# Altium schematic sheet Schema.SchDoc
size A4; SheetNumber: 2; SheetTotal: 6
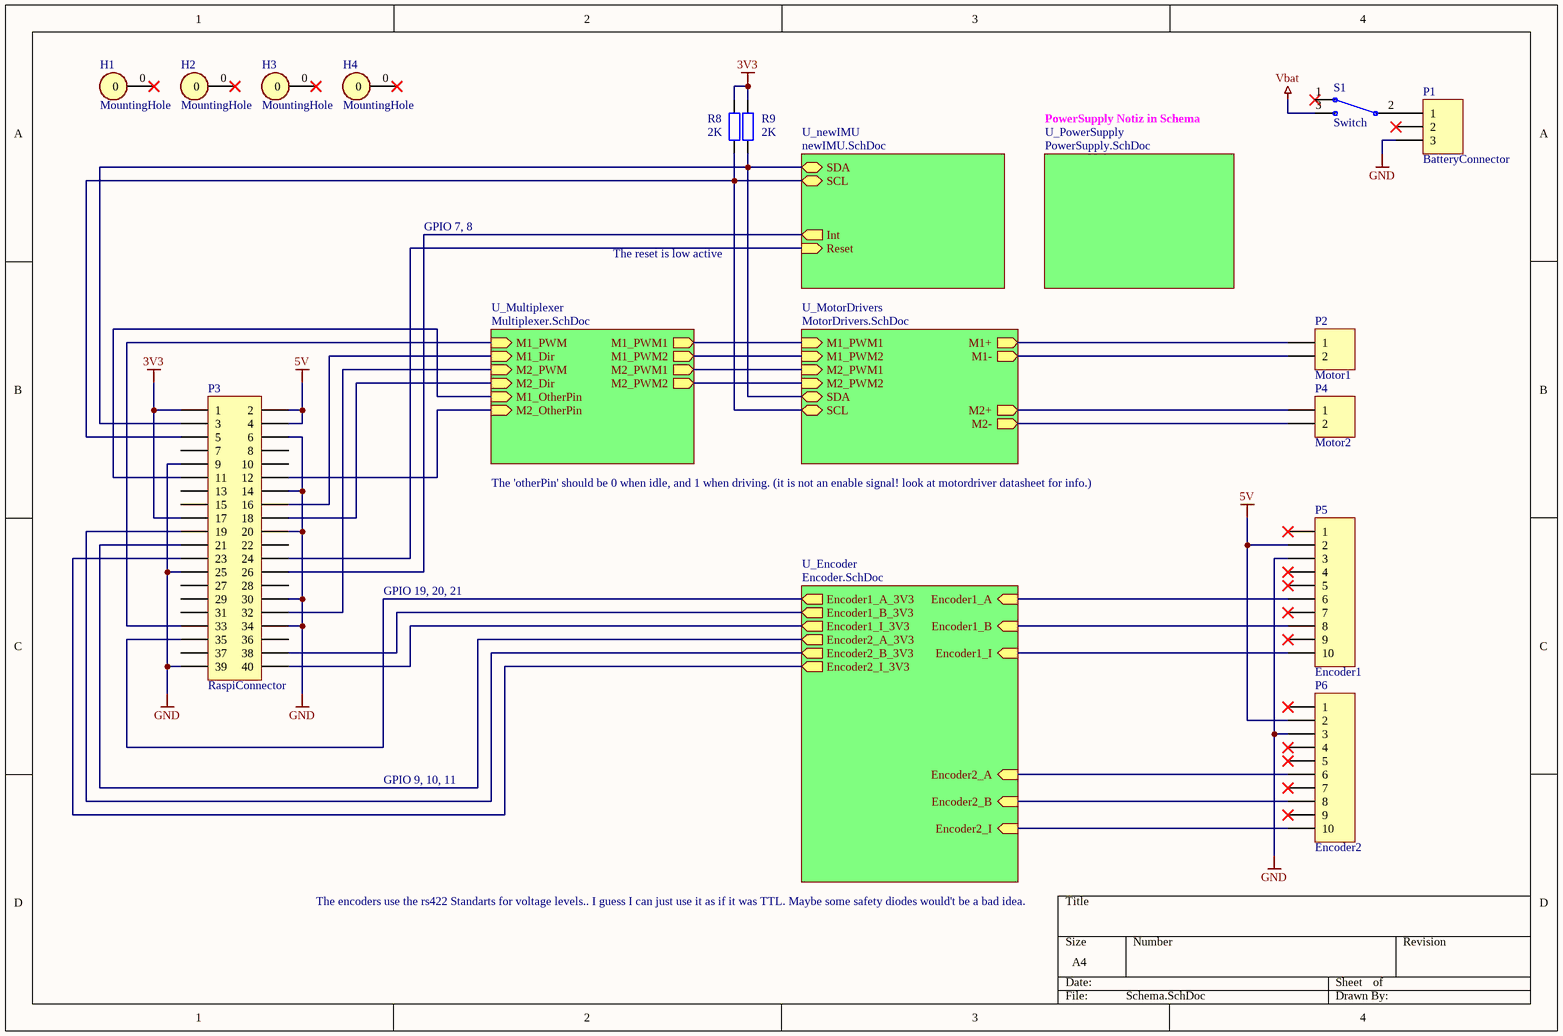
[diagram p0: Schema.SchDoc]

## Parts
H1  MountingHole  [MountingHole]
H2  MountingHole  [MountingHole]
H3  MountingHole  [MountingHole]
H4  MountingHole  [MountingHole]
P1  BatteryConnector  [BatteryConnector]
P2  Motor1  [MotorConnector]
P3  RaspiConnector  [HDR2X20]
P4  Motor2  [MotorConnector]
P5  Encoder1  [EncoderConnector]
P6  Encoder2  [EncoderConnector]
R8  value 2K  [0805_Lorin]  (hidden comment: Res2)
R9  value 2K  [0805_Lorin]  (hidden comment: Res2)
S1  Switch  [Switch]

## Sub-sheets
U_Encoder = Encoder.SchDoc: Encoder1_A (in), Encoder1_B (in), Encoder1_I (in), Encoder2_A (in), Encoder2_B (in), Encoder2_I (in), Encoder1_A_3V3 (out), Encoder1_B_3V3 (out), Encoder1_I_3V3 (out), Encoder2_A_3V3 (out), Encoder2_B_3V3 (out), Encoder2_I_3V3 (out)
U_MotorDrivers = MotorDrivers.SchDoc: M1+ (out), M1- (out), M2+ (out), M2- (out), M1_PWM1 (in), M1_PWM2 (in), M2_PWM1 (in), M2_PWM2 (in), SDA (bidir), SCL (bidir)
U_Multiplexer = Multiplexer.SchDoc: M1_PWM (in), M1_Dir (in), M2_PWM (in), M2_Dir (in), M1_PWM1 (out), M1_PWM2 (out), M2_PWM1 (out), M2_PWM2 (out), M1_OtherPin (in), M2_OtherPin (in)
U_newIMU = newIMU.SchDoc: SDA (bidir), SCL (bidir), Int (out), Reset (in)
U_PowerSupply = PowerSupply.SchDoc: no entries

## Nets
3V3: P3.1 P3.17 R8.2 R9.2
5V: P3.2 P3.4 P5.2 P6.2
GND: P1.3 P3.6 P3.9 P3.14 P3.20 P3.25 P3.30 P3.34 P3.39 P5.3 P6.3
Vbat: S1.3
NetP1_1: P1.1 S1.2
NetP2_1: P2.1 ; sheet U_MotorDrivers/M1+
NetP2_2: P2.2 ; sheet U_MotorDrivers/M1-
NetP3_3: P3.3 R9.1 ; sheet U_MotorDrivers/SDA, sheet U_newIMU/SDA
NetP3_5: P3.5 R8.1 ; sheet U_MotorDrivers/SCL, sheet U_newIMU/SCL
NetP3_11: P3.11 ; sheet U_Multiplexer/M1_OtherPin
NetP3_12: P3.12 ; sheet U_Multiplexer/M2_OtherPin
NetP3_16: P3.16 ; sheet U_Multiplexer/M1_Dir
NetP3_18: P3.18 ; sheet U_Multiplexer/M2_Dir
NetP3_19: P3.19 ; sheet U_Encoder/Encoder2_B_3V3
NetP3_21: P3.21 ; sheet U_Encoder/Encoder2_A_3V3
NetP3_23: P3.23 ; sheet U_Encoder/Encoder2_I_3V3
NetP3_24: P3.24 ; sheet U_newIMU/Reset
NetP3_26: P3.26 ; sheet U_newIMU/Int
NetP3_32: P3.32 ; sheet U_Multiplexer/M2_PWM
NetP3_33: P3.33 ; sheet U_Multiplexer/M1_PWM
NetP3_35: P3.35 ; sheet U_Encoder/Encoder1_A_3V3
NetP3_38: P3.38 ; sheet U_Encoder/Encoder1_B_3V3
NetP3_40: P3.40 ; sheet U_Encoder/Encoder1_I_3V3
NetP4_1: P4.1 ; sheet U_MotorDrivers/M2+
NetP4_2: P4.2 ; sheet U_MotorDrivers/M2-
NetP5_6: P5.6 ; sheet U_Encoder/Encoder1_A
NetP5_8: P5.8 ; sheet U_Encoder/Encoder1_B
NetP5_10: P5.10 ; sheet U_Encoder/Encoder1_I
NetP6_6: P6.6 ; sheet U_Encoder/Encoder2_A
NetP6_8: P6.8 ; sheet U_Encoder/Encoder2_B
NetP6_10: P6.10 ; sheet U_Encoder/Encoder2_I
(unnamed): sheet U_MotorDrivers/M1_PWM1, sheet U_Multiplexer/M1_PWM1
(unnamed): sheet U_MotorDrivers/M1_PWM2, sheet U_Multiplexer/M1_PWM2
(unnamed): sheet U_MotorDrivers/M2_PWM1, sheet U_Multiplexer/M2_PWM1
(unnamed): sheet U_MotorDrivers/M2_PWM2, sheet U_Multiplexer/M2_PWM2

Not connected (* = marked no-connect by the designer): H1 0*; H2 0*; H3 0*; H4 0*; P1 2*; P3 7 8 10 13 15 22 27 28 29 31 36 37; P5 1* 4* 5* 7* 9*; P6 1* 4* 5* 7* 9*; S1 1*

## Notes on the sheet
- PowerSupply Notiz in Schema
- GPIO 7, 8
- The reset is low active
- The 'otherPin' should be 0 when idle, and 1 when driving. (it is not an enable signal! look at motordriver datasheet for info.)
- GPIO 19, 20, 21
- GPIO 9, 10, 11
- The encoders use the rs422 Standarts for voltage levels.. I guess I can just use it as if it was TTL. Maybe some safety diodes would't be a bad idea.

## Library data of the parts
P1 = Header 3: Header, 3-Pin; LatestRevisionDate: 17-Jul-2002; LatestRevisionNote: Re-released for DXP Platform.; Publisher: Altium Limited
P2 P4 = Header 2: Header, 2-Pin; LatestRevisionDate: 17-Jul-2002; LatestRevisionNote: Re-released for DXP Platform.; Publisher: Altium Limited
P3 = Header 20X2: Header, 20-Pin, Dual row; LatestRevisionDate: 17-Jul-2002; LatestRevisionNote: Re-released for DXP Platform.; Publisher: Altium Limited
P5 P6 = Header 10: Header, 10-Pin; LatestRevisionDate: 17-Jul-2002; LatestRevisionNote: Re-released for DXP Platform.; Publisher: Altium Limited
R8 R9 = Res2: Resistor; Published: 8-Jun-2000; LatestRevisionDate: 17-Jul-2002; LatestRevisionNote: Re-released for DXP Platform.; PackageReference: AXIAL-0.4; Publisher: Altium Limited; PackageDescription: Axial Device, Thru-Hole; 2 Leads; 0.4 in Pin Spacing